# Altium schematic sheet framework.SchDoc
size A4
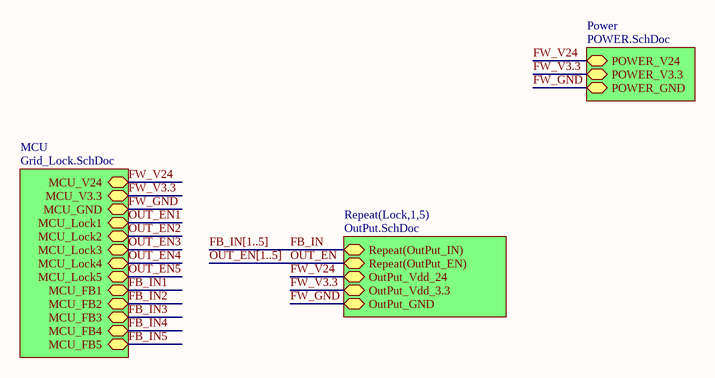
[diagram p0: framework.SchDoc]

## Sub-sheets
MCU = Grid_Lock.SchDoc: MCU_Lock4, MCU_Lock5, MCU_Lock2, MCU_FB4, MCU_FB2, MCU_FB5, MCU_FB1, MCU_Lock1, MCU_Lock3, MCU_FB3, MCU_V3.3, MCU_GND, MCU_V24
Power = POWER.SchDoc: POWER_GND, POWER_V24, POWER_V3.3
Repeat(Lock,1,5) = OutPut.SchDoc: Repeat(OutPut_IN), Repeat(OutPut_EN), OutPut_Vdd_24, OutPut_GND, OutPut_Vdd_3.3

## Nets
FB_IN: sheet Repeat(Lock,1,5)/Repeat(OutPut_IN)
FB_IN1: sheet MCU/MCU_FB1
FB_IN2: sheet MCU/MCU_FB2
FB_IN3: sheet MCU/MCU_FB3
FB_IN4: sheet MCU/MCU_FB4
FB_IN5: sheet MCU/MCU_FB5
FW_GND: sheet MCU/MCU_GND, sheet Repeat(Lock,1,5)/OutPut_GND, sheet Power/POWER_GND
FW_V3.3: sheet MCU/MCU_V3.3, sheet Repeat(Lock,1,5)/OutPut_Vdd_3.3, sheet Power/POWER_V3.3
FW_V24: sheet MCU/MCU_V24, sheet Repeat(Lock,1,5)/OutPut_Vdd_24, sheet Power/POWER_V24
OUT_EN: sheet Repeat(Lock,1,5)/Repeat(OutPut_EN)
OUT_EN1: sheet MCU/MCU_Lock1
OUT_EN2: sheet MCU/MCU_Lock2
OUT_EN3: sheet MCU/MCU_Lock3
OUT_EN4: sheet MCU/MCU_Lock4
OUT_EN5: sheet MCU/MCU_Lock5

## Buses and harness runs
bus FB_IN[1..5]
bus OUT_EN[1..5]